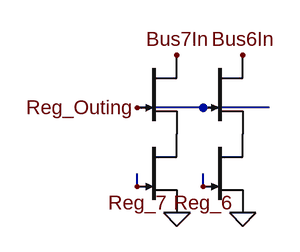
[diagram p0: schematic bus_output.asc]
bus_output.asc, the LTspice schematic file:
Version 4.1
SHEET 1 109444 42780
WIRE -4128 -1040 -4208 -1040
WIRE -4048 -1040 -4128 -1040
WIRE -4208 -944 -4208 -960
WIRE -4128 -944 -4128 -960
FLAG -4160 -912 0
FLAG -4160 -1104 Bus7In
FLAG -4208 -1040 Reg_Outing
FLAG -4208 -944 Reg_7
FLAG -4080 -912 0
FLAG -4080 -1104 Bus6In
FLAG -4128 -944 Reg_6
SYMBOL njf -4208 -1008 R0
WINDOW 0 56 32 Invisible 2
WINDOW 3 56 72 Invisible 2
SYMATTR InstName J_A1
SYMATTR Value DR
SYMBOL njf -4208 -1104 R0
WINDOW 0 56 32 Invisible 2
WINDOW 3 56 72 Invisible 2
SYMATTR InstName J_A2
SYMATTR Value DR
SYMBOL njf -4128 -1008 R0
WINDOW 0 56 32 Invisible 2
WINDOW 3 56 72 Invisible 2
SYMATTR InstName J_A2151
SYMATTR Value DR
SYMBOL njf -4128 -1104 R0
WINDOW 0 56 32 Invisible 2
WINDOW 3 56 72 Invisible 2
SYMATTR InstName J_A2152
SYMATTR Value DR

The netlist it stands for:
* bus_output.asc
J_A1 P001 Reg_7 0 DR
J_A2 Bus7In Reg_Outing P001 DR
J_A2151 P002 Reg_6 0 DR
J_A2152 Bus6In Reg_Outing P002 DR
.model NJF NJF
.model PJF PJF
.lib standard.jft
.backanno
.end